# Altium schematic sheet MOSFET Connections.SchDoc
size A3; SheetNumber: 3; SheetTotal: 12
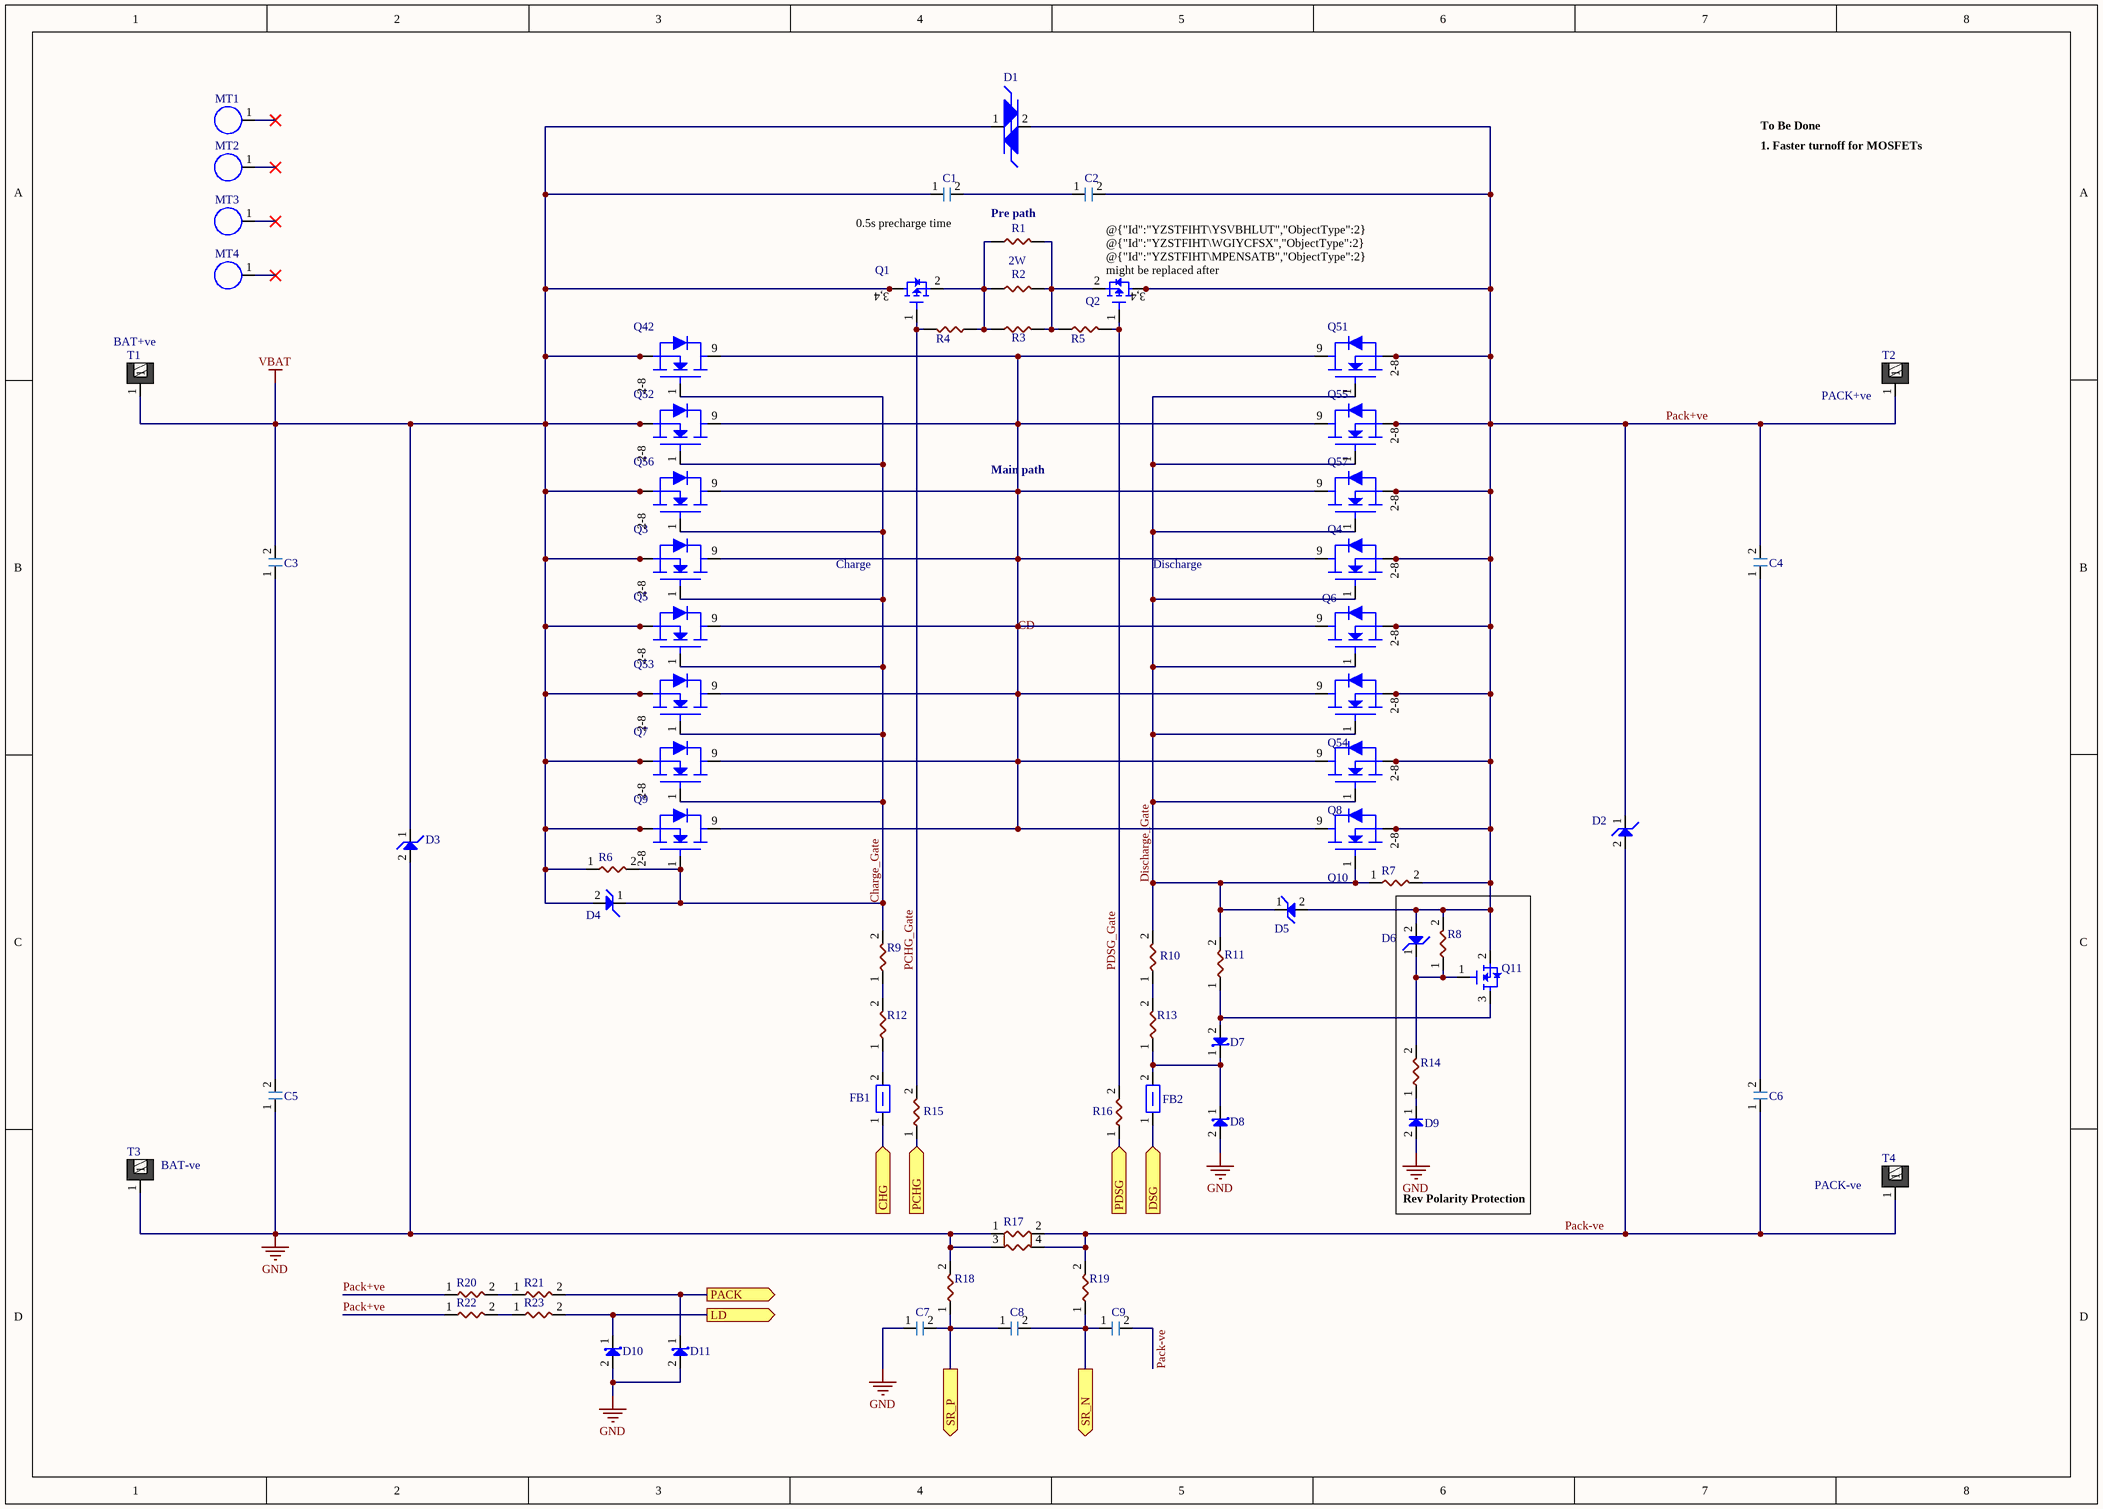
[diagram p0: MOSFET Connections.SchDoc]

## Parts
C1  CC0603KRX7R0BB104  [CAPC1608X05N 0603]  (value not drawn)
C2  CC0603KRX7R0BB104  [CAPC1608X05N 0603]  (value not drawn)
C3  CC0603KRX7R0BB104  [CAPC1608X05N 0603]  (value not drawn)
C4  CC0603KRX7R0BB104  [CAPC1608X05N 0603]  (value not drawn)
C5  CC0603KRX7R0BB104  [CAPC1608X05N 0603]  (value not drawn)
C6  CC0603KRX7R0BB104  [CAPC1608X05N 0603]  (value not drawn)
C7  GRM188R72A104KA35D  [CAPC1608X05N 0603]  (value not drawn)
C8  GRM188R72A104KA35D  [CAPC1608X05N 0603]  (value not drawn)
C9  GRM188R72A104KA35D  [CAPC1608X05N 0603]  (value not drawn)
D1  SMP100LC-140  [DIODE_SMP100LC-140]  (value not drawn)
D2  SMDJ70A  [DIODE_SMDJ70A]  (value not drawn)
D3  SMDJ70A  [DIODE_SMDJ70A]  (value not drawn)
D4  MMSZ5246BQ-7-F  [DIODE_SOD123]  (value not drawn)
D5  MMSZ5246BQ-7-F  [DIODE_SOD123]  (value not drawn)
D6  MMSZ5246BQ-7-F  [DIODE_SOD123]  (value not drawn)
D7  BAT46W-7-F  [DIODE_SOD123]  (value not drawn)
D8  BAT46W-7-F  [DIODE_SOD123]  (value not drawn)
D9  SBAS16HT1G  [DIODE_SOD323]  (value not drawn)
D10  BAT46W-7-F  [DIODE_SOD123]  (value not drawn)
D11  BAT46W-7-F  [DIODE_SOD123]  (value not drawn)
FB1  74279265  [RESC1608X05N 0603]  (value not drawn)
FB2  74279265  [RESC1608X05N 0603]  (value not drawn)
MT1  M3 Mounting Hole  [Mounting Hole]  (value not drawn)  (no BOM)
MT2  M3 Mounting Hole  [Mounting Hole]  (value not drawn)  (no BOM)
MT3  M3 Mounting Hole  [Mounting Hole]  (value not drawn)  (no BOM)
MT4  M3 Mounting Hole  [Mounting Hole]  (value not drawn)  (no BOM)
Q1  ZXMP10A17GQTA  [SOT230P700X180-4N]  (value not drawn)
Q2  ZXMP10A17GQTA  [SOT230P700X180-4N]  (value not drawn)
Q3  NVBLS0D8N08XTXG  [DPAK120P1168X240-9N]  (value not drawn)
Q4  NVBLS0D8N08XTXG  [DPAK120P1168X240-9N]  (value not drawn)
Q5  NVBLS0D8N08XTXG  [DPAK120P1168X240-9N]  (value not drawn)
Q6  NVBLS0D8N08XTXG  [DPAK120P1168X240-9N]  (value not drawn)
Q7  NVBLS0D8N08XTXG  [DPAK120P1168X240-9N]  (value not drawn)
Q8  NVBLS0D8N08XTXG  [DPAK120P1168X240-9N]  (value not drawn)
Q9  NVBLS0D8N08XTXG  [DPAK120P1168X240-9N]  (value not drawn)
Q10  NVBLS0D8N08XTXG  [DPAK120P1168X240-9N]  (value not drawn)
Q11  2N7002KW  [SOT65P210X110-3N]  (value not drawn)
Q42  NVBLS0D8N08XTXG  [DPAK120P1168X240-9N]  (value not drawn)
Q51  NVBLS0D8N08XTXG  [DPAK120P1168X240-9N]  (value not drawn)
Q52  NVBLS0D8N08XTXG  [DPAK120P1168X240-9N]  (value not drawn)
Q53  NVBLS0D8N08XTXG  [DPAK120P1168X240-9N]  (value not drawn)
Q54  NVBLS0D8N08XTXG  [DPAK120P1168X240-9N]  (value not drawn)
Q55  NVBLS0D8N08XTXG  [DPAK120P1168X240-9N]  (value not drawn)
Q56  NVBLS0D8N08XTXG  [DPAK120P1168X240-9N]  (value not drawn)
Q57  NVBLS0D8N08XTXG  [DPAK120P1168X240-9N]  (value not drawn)
R1  AC2512FK-7W200RL  [RESC6332X07N 2512]  (value not drawn)
R2  AC2512FK-7W200RL  [RESC6332X07N 2512]  (value not drawn)
R3  AC2512FK-7W200RL  [RESC6332X07N 2512]  (value not drawn)
R4  CRCW060310M0JNEA  [RESC1608X05N 0603]  (value not drawn)
R5  CRCW060310M0JNEA  [RESC1608X05N 0603]  (value not drawn)
R6  CRCW060310M0JNEA  [RESC1608X05N 0603]  (value not drawn)
R7  CRCW060310M0JNEA  [RESC1608X05N 0603]  (value not drawn)
R8  CRCW060310M0JNEA  [RESC1608X05N 0603]  (value not drawn)
R9  CRCW06035K10JNEA  [RESC1608X05N 0603]  (value not drawn)
R10  CRCW06035K10JNEA  [RESC1608X05N 0603]  (value not drawn)
R11  CRCW06035K10JNEA  [RESC1608X05N 0603]  (value not drawn)
R12  CRCW06035K10JNEA  [RESC1608X05N 0603]  (value not drawn)
R13  CRCW06035K10JNEA  [RESC1608X05N 0603]  (value not drawn)
R14  CRCW060310K0FKEA  [RESC1608X05N 0603]  (value not drawn)
R15  CRCW06035K10JNEA  [RESC1608X05N 0603]  (value not drawn)
R16  CRCW06035K10JNEA  [RESC1608X05N 0603]  (value not drawn)
R17  WSLP2726L5000FEA  [WSLP2726-X- NS]  (value not drawn)
R18  AF0603FR-07100RL  [RESC1608X05N 0603]  (value not drawn)
R19  AF0603FR-07100RL  [RESC1608X05N 0603]  (value not drawn)
R20  CRCW12065K10JNEA  [RESC3216X06N 1206]  (value not drawn)
R21  CRCW12065K10JNEA  [RESC3216X06N 1206]  (value not drawn)
R22  CRCW12065K10JNEA  [RESC3216X06N 1206]  (value not drawn)
R23  CRCW12065K10JNEA  [RESC3216X06N 1206]  (value not drawn)
T1  7461057  [7461057]  (value not drawn)
T2  7461057  [7461057]  (value not drawn)
T3  7461057  [7461057]  (value not drawn)
T4  7461057  [7461057]  (value not drawn)

## Blocks framed on the sheet
Rev Polarity Protection: D6 D9 Q11 R8 R14

## Ports
CHG (in), DSG (in), LD (out), PACK (out), PCHG (in), PDSG (in), SR_N (out), SR_P (out)

## Nets
GND: C5.1 C7.1 D3.2(Anode) D8.2(Anode) D9.2(Anode) D10.2(Anode) D11.2(Anode) R17.1 R17.3 R18.2 T3.1
VBAT: C1.1 C3.2 D1.1 D3.1(Cathode) D4.2(Anode) Q1.3(Drain) Q1.4(Drain) Q3.2(Source) Q3.3(Source) Q3.4(Source) Q3.5(Source) Q3.6(Source) Q3.7(Source) Q3.8(Source) Q5.2(Source) Q5.3(Source) Q5.4(Source) Q5.5(Source) Q5.6(Source) Q5.7(Source) Q5.8(Source) Q7.2(Source) Q7.3(Source) Q7.4(Source) Q7.5(Source) Q7.6(Source) Q7.7(Source) Q7.8(Source) Q9.2(Source) Q9.3(Source) Q9.4(Source) Q9.5(Source) Q9.6(Source) Q9.7(Source) Q9.8(Source) Q42.2(Source) Q42.3(Source) Q42.4(Source) Q42.5(Source) Q42.6(Source) Q42.7(Source) Q42.8(Source) Q52.2(Source) Q52.3(Source) Q52.4(Source) Q52.5(Source) Q52.6(Source) Q52.7(Source) Q52.8(Source) Q53.2(Source) Q53.3(Source) Q53.4(Source) Q53.5(Source) Q53.6(Source) Q53.7(Source) Q53.8(Source) Q56.2(Source) Q56.3(Source) Q56.4(Source) Q56.5(Source) Q56.6(Source) Q56.7(Source) Q56.8(Source) R6.1 T1.1
CD: Q3.9(Drain) Q4.9(Drain) Q5.9(Drain) Q6.9(Drain) Q7.9(Drain) Q8.9(Drain) Q9.9(Drain) Q10.9(Drain) Q42.9(Drain) Q51.9(Drain) Q52.9(Drain) Q53.9(Drain) Q54.9(Drain) Q55.9(Drain) Q56.9(Drain) Q57.9(Drain)
Charge_Gate: D4.1(Cathode) Q3.1(Gate) Q5.1(Gate) Q7.1(Gate) Q9.1(Gate) Q42.1(Gate) Q52.1(Gate) Q53.1(Gate) Q56.1(Gate) R6.2 R9.2
CHG: FB1.1 ; port CHG
Discharge_Gate: D5.1(Cathode) Q4.1(Gate) Q6.1(Gate) Q8.1(Gate) Q10.1(Gate) Q51.1(Gate) Q54.1(Gate) Q55.1(Gate) Q57.1(Gate) R7.1 R10.2 R11.2
DSG: FB2.1 ; port DSG
LD: D10.1(Cathode) R23.2 ; port LD
PACK: D11.1(Cathode) R21.2 ; port PACK
Pack+ve: C2.2 C4.2 D1.2 D2.1(Cathode) D5.2(Anode) D6.2(Anode) Q2.3(Drain) Q2.4(Drain) Q4.2(Source) Q4.3(Source) Q4.4(Source) Q4.5(Source) Q4.6(Source) Q4.7(Source) Q4.8(Source) Q6.2(Source) Q6.3(Source) Q6.4(Source) Q6.5(Source) Q6.6(Source) Q6.7(Source) Q6.8(Source) Q8.2(Source) Q8.3(Source) Q8.4(Source) Q8.5(Source) Q8.6(Source) Q8.7(Source) Q8.8(Source) Q10.2(Source) Q10.3(Source) Q10.4(Source) Q10.5(Source) Q10.6(Source) Q10.7(Source) Q10.8(Source) Q11.2(Source) Q51.2(Source) Q51.3(Source) Q51.4(Source) Q51.5(Source) Q51.6(Source) Q51.7(Source) Q51.8(Source) Q54.2(Source) Q54.3(Source) Q54.4(Source) Q54.5(Source) Q54.6(Source) Q54.7(Source) Q54.8(Source) Q55.2(Source) Q55.3(Source) Q55.4(Source) Q55.5(Source) Q55.6(Source) Q55.7(Source) Q55.8(Source) Q57.2(Source) Q57.3(Source) Q57.4(Source) Q57.5(Source) Q57.6(Source) Q57.7(Source) Q57.8(Source) R7.2 R8.2 R20.1 R22.1 T2.1
Pack-ve: C6.1 C9.2 D2.2(Anode) R17.2 R17.4 R19.2 T4.1
PCHG: R15.1 ; port PCHG
PCHG_Gate: Q1.1(Gate) R4.2 R15.2
PDSG: R16.1 ; port PDSG
PDSG_Gate: Q2.1(Gate) R5.2 R16.2
SR_N: C8.2 C9.1 R19.1 ; port SR_N
SR_P: C7.2 C8.1 R18.1 ; port SR_P
NetC1_2: C1.2 C2.1
NetC3_1: C3.1 C5.2
NetC4_1: C4.1 C6.2
NetD6_1: D6.1(Cathode) Q11.1(Gate) R8.1 R14.2
NetD7_1: D7.1(Cathode) D8.1(Cathode) FB2.2 R13.1
NetD7_2: D7.2(Anode) Q11.3(Drain) R11.1
NetD9_1: D9.1(Cathode) R14.1
NetFB1_2: FB1.2 R12.1
NetQ1_2: Q1.2(Source) R1.1 R2.1 R3.1 R4.1
NetQ2_2: Q2.2(Source) R1.2 R2.2 R3.2 R5.1
NetR9_1: R9.1 R12.2
NetR10_1: R10.1 R13.2
NetR20_2: R20.2 R21.1
NetR22_2: R22.2 R23.1

Not connected (* = marked no-connect by the designer): MT1 1*; MT2 1*; MT3 1*; MT4 1*

## Notes on the sheet
- 1. Faster turnoff for MOSFETs
- To Be Done
- (near C1) 0.5s precharge time
- (near R1) Pre path
- 2W
- (near Q2) @{"Id":"YZSTFIHT\YSVBHLUT","ObjectType":2} @{"Id":"YZSTFIHT\WGIYCFSX","ObjectType":2} @{"Id":"YZSTFIHT\MPENSATB","ObjectType":2} might be replaced after testing. Increase resistance in case of heating
- (near T1) BAT+ve
- (near T2) PACK+ve
- Main path
- Charge
- Discharge
- (near T3) BAT-ve
- (near T4) PACK-ve
- (in symbol FET_NVBLS0D8N08XTXG) 2-8
- (in symbol FET_ZXMP10A17GQTA) 3,4

## Library data of the parts
C1-C6 = Cap_CC0603KRX7R0BB104: Multilayer Ceramic Capacitor, 0.1uF, 100V, ±10%,  X7R 0603 [1608 Metric]; Manufacturer: Yageo; AEC-Q: NA; Max Temp: 125 degC; Min Temp: -55 degC; Polarized: No; Value Display: 0.1uF,100V,0603; Category: Capacitor; ComponentLink1Description: Datasheet; ComponentLink1URL: https://www.yageo.com/upload/media/product/app/datasheet/mlcc/upy-np0x7r_mv_100-to-630v.pdf; Manufacturer Part Number: CC0603KRX7R0BB104; Mount Type: Surface Mount; Package: 0603; RoHS: Yes; Supplier 1: Digikey; Supplier 1 Part Number: 311-1523-1-ND; Supplier 1 pricing per Unit: 14.19 INR; Supplier: Mouser; Supplier Part Number: 603-CC603KRX7R0BB104; Supplier pricing per Unit: 14.19 INR; Technology: Ceramic; Temp Coefficient: X7R; Tolerance: 10%; Value 1: CC0603KRX7R0BB104; Value: 0.1uF; Voltage: 100V
C7-C9 = Cap_GRM188R72A104KA35D: Multilayer Ceramic Capacitor, 100 nF, 100 V, ± 10%, X7R, 0603 [1608 Metric]; Manufacturer: Murata; AEC-Q: NA; Max Temp: 125 degC; Min Temp: -55 degC; Polarized: No; Value: 100 nF; Value Display: 100nF, 100V,0603; Voltage: 100V; Category: Capacitor; ComponentLink1Description: Datasheet; ComponentLink1URL: https://search.murata.co.jp/Ceramy/image/img/A01X/G101/ENG/GRM188R72A104KA35-01.pdf; Manufacturer Part Number: GRM188R72A104KA35D; Mount Type: Surface Mount; Package: 0603; RoHS: Yes; Supplier 1: Digikey; Supplier 1 Part Number: 490-3285-1-ND; Supplier 1 pricing per Unit: 17.71 INR; Supplier: Mouser; Supplier Part Number: 81-GRM188R72A104KA35; Supplier pricing per Unit: 17.71 INR; Technology: Ceramic; Temp Coefficient: X7R; Tolerance: 10%; Value 1: GRM188R72A104KA35D
D1 = Diode_TVS_SMP100LC-140: 140V Off-State 400 A Ipp TVS Thyristor DO-214AA, SMB; Manufacturer: ST; AEC-Q: NA; Category: TVS Diode; ComponentLink1Description: Datasheet; ComponentLink1URL: https://www.st.com/content/ccc/resource/technical/document/datasheet/56/56/46/9e/00/a0/48/db/CD00002051.pdf/files/CD00002051.pdf/jcr:content/translations/en.CD00002051.pdf; Manufacturer Part Number: SMP100LC-140; Max Temp: NA; Min Temp: NA; Mount Type: Surface Mount; Package: DO-214AA, SMB; RoHS: Yes; Supplier 1: Digikey; Supplier 1 Part Number: 497-4088-1-ND; Supplier 1 pricing per Unit: 63.38 INR; Supplier: Mouser; Supplier Part Number: 511-SMP100LC-140; Supplier pricing per Unit: 63.38 INR; Value 1: SMP100LC-140; Value: 140V; Value Display: 140V; Voltage: 140V
D2 D3 = Diode_TVS_SMDJ70A: 113V Clamp 31A Ipp Tvs Diode Surface Mount DO-214AB (SMCJ); Manufacturer: LittleFuse; AEC-Q: NA; Max Temp: 150 degC; Min Temp: -65 degC; Power: 3kW (Peak); Category: TVS Diode; ComponentLink1Description: Datasheet; ComponentLink1URL: https://www.littelfuse.com/media?resourcetype=datasheets&itemid=2d9772b3-822b-4362-914d-b74e0a706638&filename=littelfuse-tvs-diode-smdj-datasheet; Manufacturer Part Number: SMDJ70A; Mount Type: Surface Mount; Package: DO-214AB (SMCJ); RoHS: Yes; Supplier 1: Digikey; Supplier 1 Part Number: SMDJ70ACT-ND; Supplier 1 pricing per Unit: 74.28 INR; Supplier: Mouser; Supplier Part Number: 576-SMDJ70A; Supplier pricing per Unit: 73.39 INR; Value 1: SMDJ70A; Value: 113V; Value Display: 113V; Voltage: 113V
D4-D6 = Diode_MMSZ5246BQ-7-F: Zener Diode 16 V 500 mW ±5% Surface Mount SOD-123; Manufacturer: Diodes Inc.; AEC-Q: 101; Forward Current: 30mA; Forward Voltage: 900 mV @ 10 mA; Max Temp: 150 degC; Min Temp: -65 degC; Power: 370mW; Value: 16V 30mA; Voltage: 16V; Category: Diode; ComponentLink1Description: Datasheet; ComponentLink1URL: https://www.diodes.com/assets/Datasheets/ds18010.pdf; Manufacturer Part Number: MMSZ5246BQ-7-F; Mount Type: Surface Mount; Package: SOD 123; RoHS: Yes; Supplier 1: Digikey; Supplier 1 Part Number: 31-MMSZ5246BQ-7-FTR-ND; Supplier: Mouser; Value 1: MMSZ5246BQ-7-F; Value Display: 16V 30mA; Supplier 1 pricing per Unit: 17.9 INR; Supplier Part Number: 621-MMSZ5246BQ-7-F; Supplier pricing per Unit: 17.71 INR
D7 D8 D10 D11 = Diode_BAT46W-7-F: Diode 100 V 150mA Surface Mount SOD-123; Manufacturer: Diodes Inc.; AEC-Q: NA; Forward Voltage: 450mV @ 10mA; Max Temp: 125 degC; Min Temp: -55 degC; Power: 200mW; Voltage: 100V; Category: Diode; ComponentLink1Description: Datasheet; ComponentLink1URL: https://www.diodes.com/assets/Datasheets/BAT46W.pdf; Forward Current: 150mA; Manufacturer Part Number: BAT46W-7-F; Mount Type: Surface Mount; Package: SOD 123; RoHS: Yes; Supplier 1: Digikey; Supplier 1 Part Number: BAT46W-7FDICT-ND; Supplier 1 pricing per Unit: 32.55 INR; Supplier: Mouser; Supplier Part Number: 621-BAT46W-7-F; Supplier pricing per Unit: 25.02 INR; Value 1: BAT46W-7-F; Value: 100V 150mA; Value Display: 100V 150mA
D9 = Diode_SBAS16HT1G: DIODE GEN PURP 100V 200MA SOD323; Manufacturer: OnSemi; AEC-Q: 101; Max Temp: 150 degC; Min Temp: -55 degC; Forward Voltage: 1.25V @150mA; Power: 200mW; Value: 100V 200mA; Manufacturer Part Number: SBAS16HT1G; Supplier: Mouser; Supplier 1 pricing per Unit: 10.84 INR; Package: SOD 323; Category: Diode; RoHS: Yes; ComponentLink1Description: Datasheet; ComponentLink1URL: https://www.onsemi.com/pdf/datasheet/bas16ht1-d.pdf; Supplier 1: Digikey; Value 1: SBAS16HT1G; Value Display: 100V 200mA; Voltage: 100V; Supplier 1 Part Number: SBAS16HT1GOSCT-ND; Supplier Part Number: 863-SBAS16HT1G; Supplier pricing per Unit: 15.01 INR; Mount Type: Surface Mount; Forward Current: 200mA
FB1 FB2 = FB_74279265: 600 Ohms @ 100 MHz 1 Signal Line Ferrite Bead 0603 (1608 Metric) 200mA 450mOhm; Manufacturer: Wurth Electronik; AEC-Q: 200; Max Temp: 125 degC; Min Temp: -55 degC; Value 1: 600 Ohms @100MHHz; Category: Ferrite Bead; ComponentLink1Description: Datasheet; ComponentLink1URL: https://www.we-online.com/components/products/datasheet/74279265.pdf; Manufacturer Part Number: 74279265; Mount Type: Surface Mount; Package: 0603; RoHS: Yes; Supplier 1: Digikey; Supplier 1 Part Number: 732-1583-1-ND; Supplier 1 pricing per Unit: 15.07 INR; Supplier: Mouser; Supplier Part Number: 710-74279265; Supplier pricing per Unit: 14.10 INR; Value: 74279265; Value Display: 600 Ohms
MT1-MT4 = Mounting Hole M3
Q1 Q2 = FET_ZXMP10A17GQTA: P-Channel 100 V 2.4A (Ta) 2W (Ta) Surface Mount SOT-223-3; Manufacturer: Diodes Inc.; AEC-Q: 101; Forward Voltage: 100V; Max Temp: 150 degC; Min Temp: -55 degC; Rds ON: 350mΩ @ 2.4A @ -10V; Category: MOSFET; ComponentLink1Description: Datasheet; ComponentLink1URL: https://www.diodes.com/assets/Datasheets/ZXMP10A17GQ.pdf; Forward Current: 2.4A; Manufacturer Part Number: ZXMP10A17GQTA; Mount Type: Surface Mount; Package: SOT 23-3; Power: 2W; RoHS: Yes; Supplier 1: Digikey; Supplier 1 Part Number: ZXMP10A17GQTADICT-ND; Supplier 1 pricing per Unit: 85.13 INR; Supplier: Mouser; Supplier Part Number: 621-ZXMP10A17GQTA; Supplier pricing per Unit: 85.07 INR; Value 1: ZXMP10A17GQTA; Value: 100V 2.4A; Value Display: 100V 2.4A; Voltage: 100V; Channel: P-Channel
Q3-Q10 Q42 Q51-Q57 = FET_NVBLS0D8N08XTXG: N-Channel 80 V 457A (Tc) 325W (Tc) Surface Mount 8-HPSOF; Manufacturer: OnSemi; Voltage: 80V; AEC-Q: 101; Max Temp: 175 degC; Min Temp: -55 degC; Rds ON: 0.79mOhms @80A,10V; Manufacturer Part Number: NVBLS0D8N08XTXG; Value: 80V 457A; Package: 8 HPSOF; RoHs: Yes; Category: MOSFET; Supplier: Mouser; Supplier 1 pricing per Unit: 575.53 INR; ComponentLink1Description: Datasheet; ComponentLink1URL: https://www.onsemi.com/download/data-sheet/pdf/nvbls0d8n08x-d.pdf; Supplier 1: Digikey; Value 1: NVBLS0D8N08XTXG; Value Display: 80V 457A; Supplier 1 Part Number: 488-NVBLS0D8N08XTXGCT-ND; Supplier Part Number: 863-NVBLS0D8N08XTXG; Supplier pricing per Unit: 574.63 INR; Mount Type: Surface Mount; Forward Current: 457A; Forward Voltage: 80V; Power: 325W; Channel: N-Channel
Q11 = FET_2N7002KW: N-Channel 60 V 310mA (Ta) 350mW (Ta) Surface Mount SOT-323; Manufacturer: OnSemi; AEC-Q: NA; Forward Voltage: 60V; Max Temp: 150 degC; Min Temp: -55 degC; Rds ON: 1.6Ohms @500mA 10V; Category: MOSFET; ComponentLink1Description: Datasheet; ComponentLink1URL: https://www.onsemi.com/pdf/datasheet/2n7002kw-d.pdf; Forward Current: 310mA; Manufacturer Part Number: 2N7002KW; Mount Type: Surface Mount; Package: SOT 32-3; Power: 350mW; RoHS: Yes; Supplier 1: Digikey; Supplier: Mouser; Value 1: 2N7002KW; Value: 60V 310mA; Value Display: 60V 310mA; Voltage: 60V; Channel: N-Channel
R1-R3 = Res_AC2512FK-7W200RL: 200 Ohms ±1% 2W Chip Resistor 2512 (6432 Metric) Automotive AEC-Q200, Moisture Resistant Thick Film; Manufacturer: Yageo; AEC-Q: 200; Max Temp: 155 degC; Min Temp: -55 degC; Value: 200R; Value Display: 200E, 1%,2512; Category: Resistor; ComponentLink1Description: Datasheet; ComponentLink1URL: https://www.yageo.com/upload/media/product/productsearch/datasheet/rchip/PYu-AC_51_RoHS_L_10.pdf; Manufacturer Part Number: AC2512FK-7W200RL; Mount Type: Surface Mount; Package: 2512; Power: 2W; RoHS: Yes; Supplier 1: Digikey; Supplier 1 Part Number: 13-AC2512FK-7W200RLTR-ND; Supplier 1 pricing per Unit: NA; Supplier: Mouser; Supplier Part Number: 603-AC2512FK-7W200RL; Supplier pricing per Unit: 60.05 INR; Tolerance: 1%; Value 1: AC2512FK-7W200RL
R4-R8 = Res_CRCW060310M0JNEA: SMD Chip Resistor, 10 MOhm,±5%, 100 mW, 0603 [1608 Metric], Thick Film, General Purpose; Manufacturer: Vishay Dale; AEC-Q: 200; Max Temp: 155 degC; Min Temp: -55 degC; Power: 1/10W; Value: 10M R; Value Display: 10ME, 5%, 0603; Category: Resistor; ComponentLink1Description: Datasheet; ComponentLink1URL: https://www.vishay.com/docs/20035/dcrcwe3.pdf; Manufacturer Part Number: CRCW060310M0JNEA; Mount Type: Surface Mount; Package: 0603; RoHS: Yes; Supplier 1: Digikey; Supplier 1 Part Number: 541-10MGCT-ND; Supplier 1 pricing per Unit: 8.34 INR; Supplier: Mouser; Supplier Part Number: 71-CRCW0603J-10M-E3; Supplier pricing per Unit: 8.34 INR; Tolerance: 5%; Value 1: CRCW060310M0JNEA
R9-R13 R15 R16 = Res_CRCW06035K10JNEA: SMD Chip Resistor, 5.1k Ohm, ± 5%, 250 mW, 0603 [1608 Metric], Thick Film, General Purpose; Manufacturer: Vishay Dale; AEC-Q: 200; Max Temp: 155 degC; Min Temp: -55 degC; Power: 1/10W; Value: 5.1k R; Value Display: 5.1kE, 5%,0603; Manufacturer Part Number: CRCW06035K10JNEA; Category: Resistor; ComponentLink1Description: Datasheet; ComponentLink1URL: https://www.vishay.com/docs/20035/dcrcwe3.pdf; Mount Type: Surface Mount; Package: 0603; RoHS: Yes; Supplier 1: Digikey; Supplier 1 Part Number: 541-5.1KGCT-ND; Supplier 1 pricing per Unit: 8.34 INR; Supplier: Mouser; Supplier Part Number: 71-CRCW0603J-5.1K-E3; Supplier pricing per Unit: 8.34 INR; Tolerance: 5%; Value 1: CRCW06035K10JNEA
R14 = Res_CRCW060310K0FKEA: SMD Chip Resistor, 10 kOhm,±1%, 100 mW, 0603 [1608 Metric], Thick Film, General Purpose; Manufacturer: Vishay Dale; AEC-Q: 200; Max Temp: 155 degC; Min Temp: -55 degC; Power: 1/10W; Value: 10k R; Value Display: 10kE, 1%, 0603; Category: Resistor; ComponentLink1Description: Datasheet; ComponentLink1URL: https://www.vishay.com/docs/20035/dcrcwe3.pdf; Manufacturer Part Number: CRCW060310K0FKEA; Mount Type: Surface Mount; Package: 0603; RoHS: Yes; Supplier 1: Digikey; Supplier 1 Part Number: 541-10.0KHCT-ND; Supplier 1 pricing per Unit: 8.34 INR; Supplier: Mouser; Supplier Part Number: 71-CRCW0603-10K-E3; Supplier pricing per Unit: 8.34 INR; Tolerance: 1%; Value 1: CRCW060310K0FKEA
R17 = Res_WSLP2726L5000FEA: 0.5 mOhms ±1% 7W Chip Resistor Nonstandard Anti-Sulfur, Automotive AEC-Q200, Current Sense, Moisture Resistant, Pulse Withstanding Metal Element; Manufacturer: Vishay Dale; AEC-Q: 200; Max Temp: 175 degC; Min Temp: -60 degC; Value: 0.5m R; Value Display: 0.5mE, 1%; Category: Shunt Resistor; ComponentLink1Description: Datasheet; ComponentLink1URL: https://www.vishay.com/docs/30179/wslp2726.pdf; Manufacturer Part Number: WSLP2726L5000FEA; Mount Type: Surface Mount; Package: NS; Power: 7W; RoHS: Yes; Supplier 1: Digikey; Supplier 1 Part Number: 541-4377-1-ND; Supplier 1 pricing per Unit: 237.03 INR; Supplier: Mouser; Supplier Part Number: 71-WSLP2726L5000FEA; Supplier pricing per Unit: 202.66 INR; Tolerance: 1%; Value 1: WSLP2726L5000FEA
R18 R19 = Res_AF0603FR-07100RL: SMD Chip Resistor,100 Ohms ±1%, 1/10W, 0603 (1608 Metric) Anti-Sulfur, Automotive AEC-Q200 Thick Film; Manufacturer: Yageo; Value: 100R; Value Display: 100E, 1%,0603; AEC-Q: 200; Max Temp: 155 degC; Min Temp: -55 degC; Category: Resistor; Tolerance: 1%; Package: 0603; Manufacturer Part Number: AF0603FR-07100RL; RoHS: Yes; Power: 1/10W; Supplier: Mouser; Supplier 1 pricing per Unit: 8.34 INR; ComponentLink1Description: Datasheet; ComponentLink1URL: https://www.yageo.com/upload/media/product/app/datasheet/rchip/pyu-af_51_rohs_l.pdf; Supplier 1: Digikey; Value 1: AF0603FR-07100RL; Supplier 1 Part Number: 13-AC0603FR-10150RLCT-ND; Supplier Part Number: 603-AF0603FR-07100RL; Supplier pricing per Unit: 8.34 INR; Mount Type: Surface Mount
R20-R23 = Res_CRCW12065K10JNEA: SMD Chip Resistor, 5.1k Ohm, ± 5%, 250 mW, 1206 [3216 Metric], Thick Film, General Purpose; Manufacturer: Vishay Dale; AEC-Q: 200; Max Temp: 155 degC; Min Temp: -55 degC; Power: 1/4W; Value: 5.1k R; Value Display: 5.1kE, 5%,1206; Manufacturer Part Number: CRCW12065K10JNEA; Category: Resistor; ComponentLink1Description: Datasheet; ComponentLink1URL: https://www.vishay.com/docs/20035/dcrcwe3.pdf; Mount Type: Surface Mount; Package: 1206; RoHS: Yes; Supplier 1: Digikey; Supplier 1 Part Number: 541-5.1KECT-ND; Supplier 1 pricing per Unit: 8.34 INR; Supplier: Mouser; Supplier Part Number: 71-CRCW1206J-5.1K-E3; Supplier pricing per Unit: 8.34 INR; Tolerance: 5%; Value 1: CRCW12065K10JNEA
T1-T4 = Terminal_7461057: 6 Pin Screw Terminal, Power Tap M3 Through Hole; Manufacturer: Wurth Electronik; Value: 100 A; Value Display: M3 Screw Terminal; Category: Terminal; ComponentLink1Description: Datasheet; ComponentLink1URL: https://www.we-online.com/components/products/datasheet/7461057.pdf; Manufacturer Part Number: 7461057; Mount Type: TH; Package: TH; RoHS: Yes; Supplier 1: Digikey; Supplier 1 Part Number: 732-3200-ND; Supplier 1 pricing per Unit: 213.66 INR; Supplier: Mouser; Supplier Part Number: 710-7461057; Supplier pricing per Unit: 213.30 INR; Value 1: 7461057